# EAGLE schematic arduino_shield (EAGLE 7.1.0)

## Sheet 1 of 2: Arduino Sheild
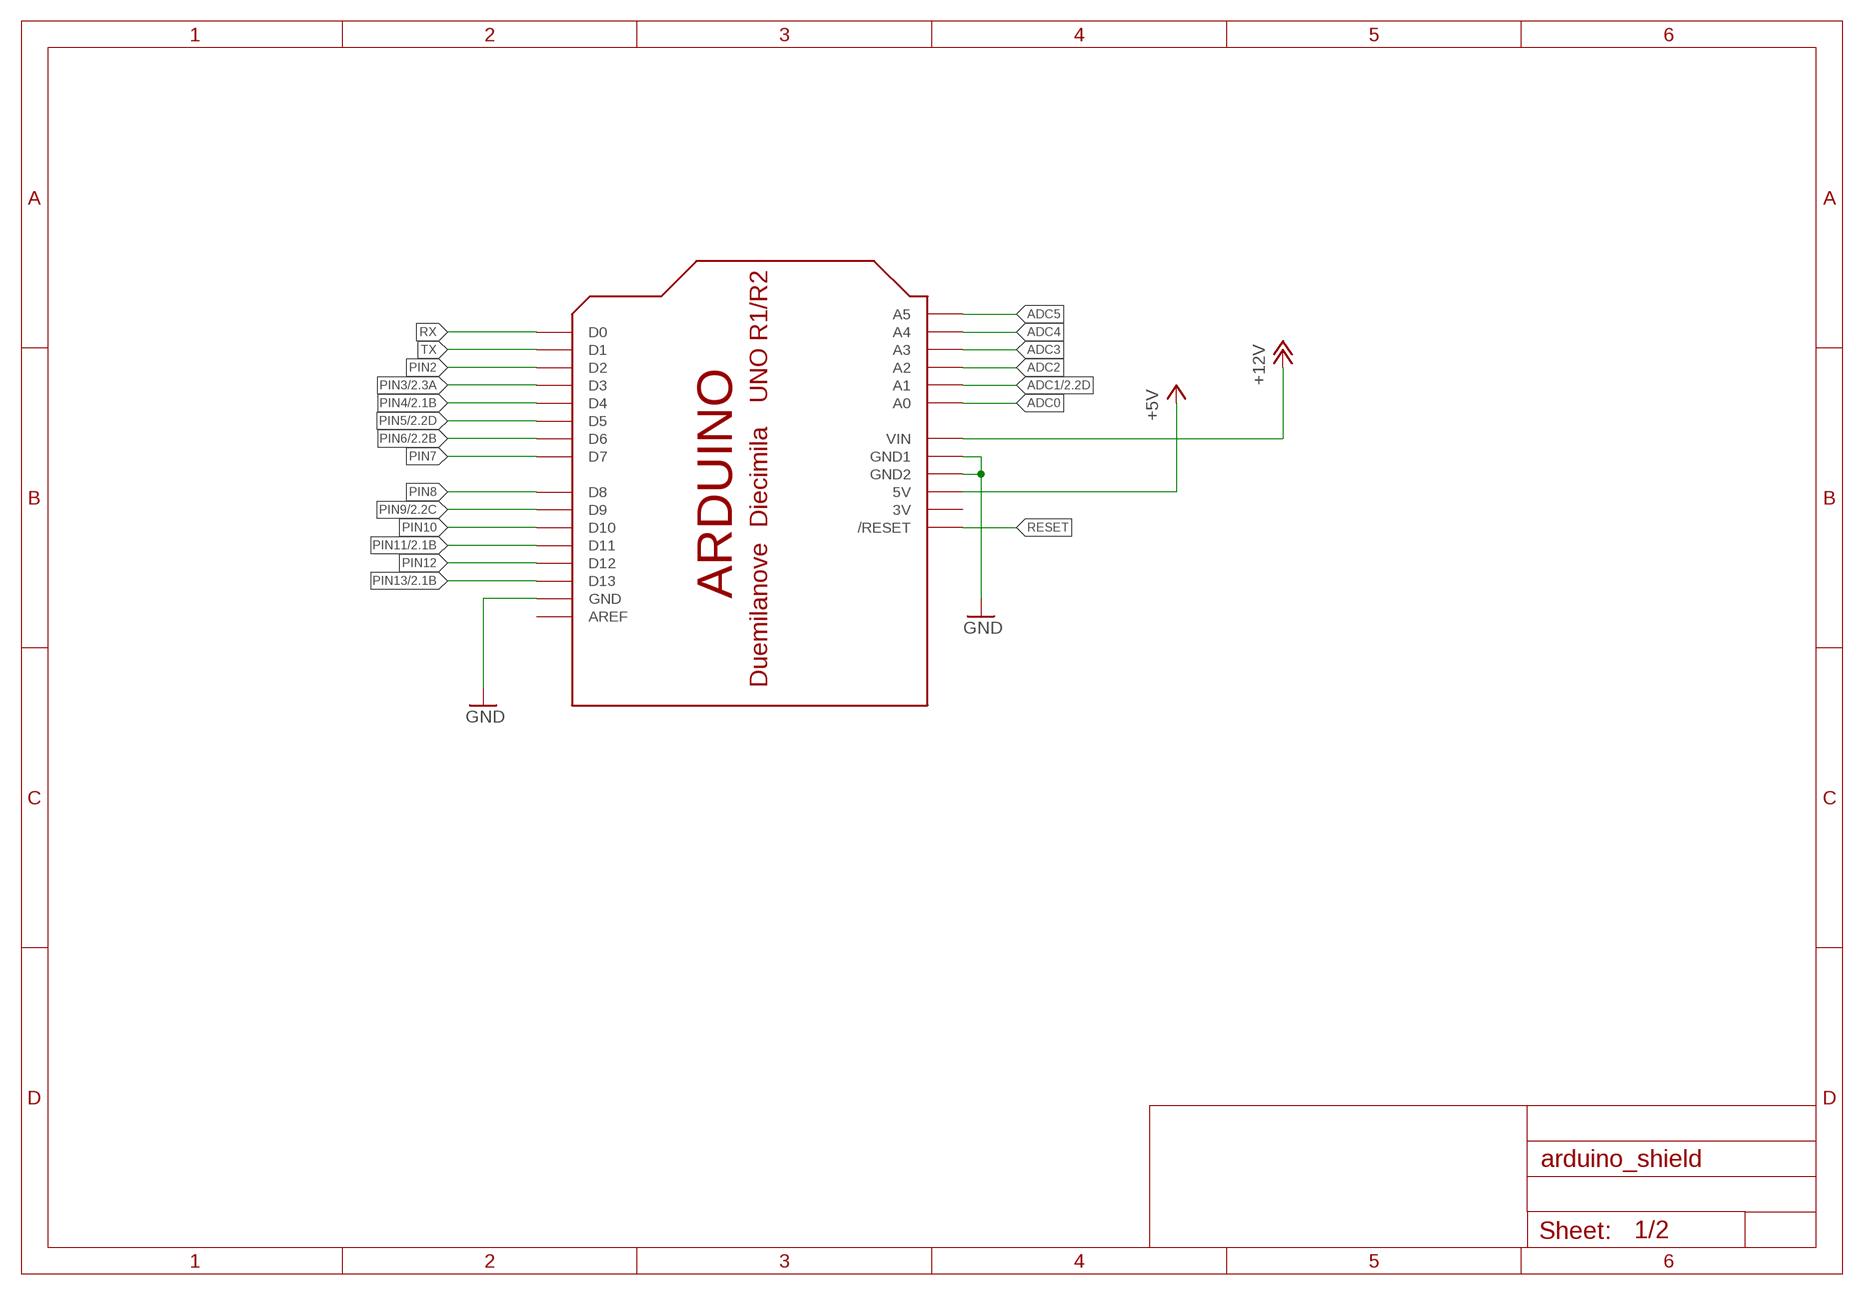
[diagram p0: schematic, sheet 1]

### Parts
GND  ARDUINOUNO  [ARDUINO]

### Nets
+5V: GND.5V ; also sheet 2
+12V: GND.VIN ; also sheet 2
ADC0: GND.A0
ADC1: GND.A1 ; also sheet 2
ADC2: GND.A2
ADC3: GND.A3
ADC4: GND.A4
ADC5: GND.A5
GND: GND.GND GND.GND1 GND.GND2 ; also sheet 2
PIN2: GND.D2
PIN3: GND.D3 ; also sheet 2
PIN4: GND.D4 ; also sheet 2
PIN5: GND.D5 ; also sheet 2
PIN6: GND.D6 ; also sheet 2
PIN7: GND.D7
PIN8: GND.D8
PIN9: GND.D9 ; also sheet 2
PIN10: GND.D10
PIN11: GND.D11 ; also sheet 2
PIN12: GND.D12
PIN13: GND.D13 ; also sheet 2
RESET: GND.RESET(/RESET)
RX: GND.D0
TX: GND.D1
Unconnected: GND.AREF

## Sheet 2 of 2: Output stage
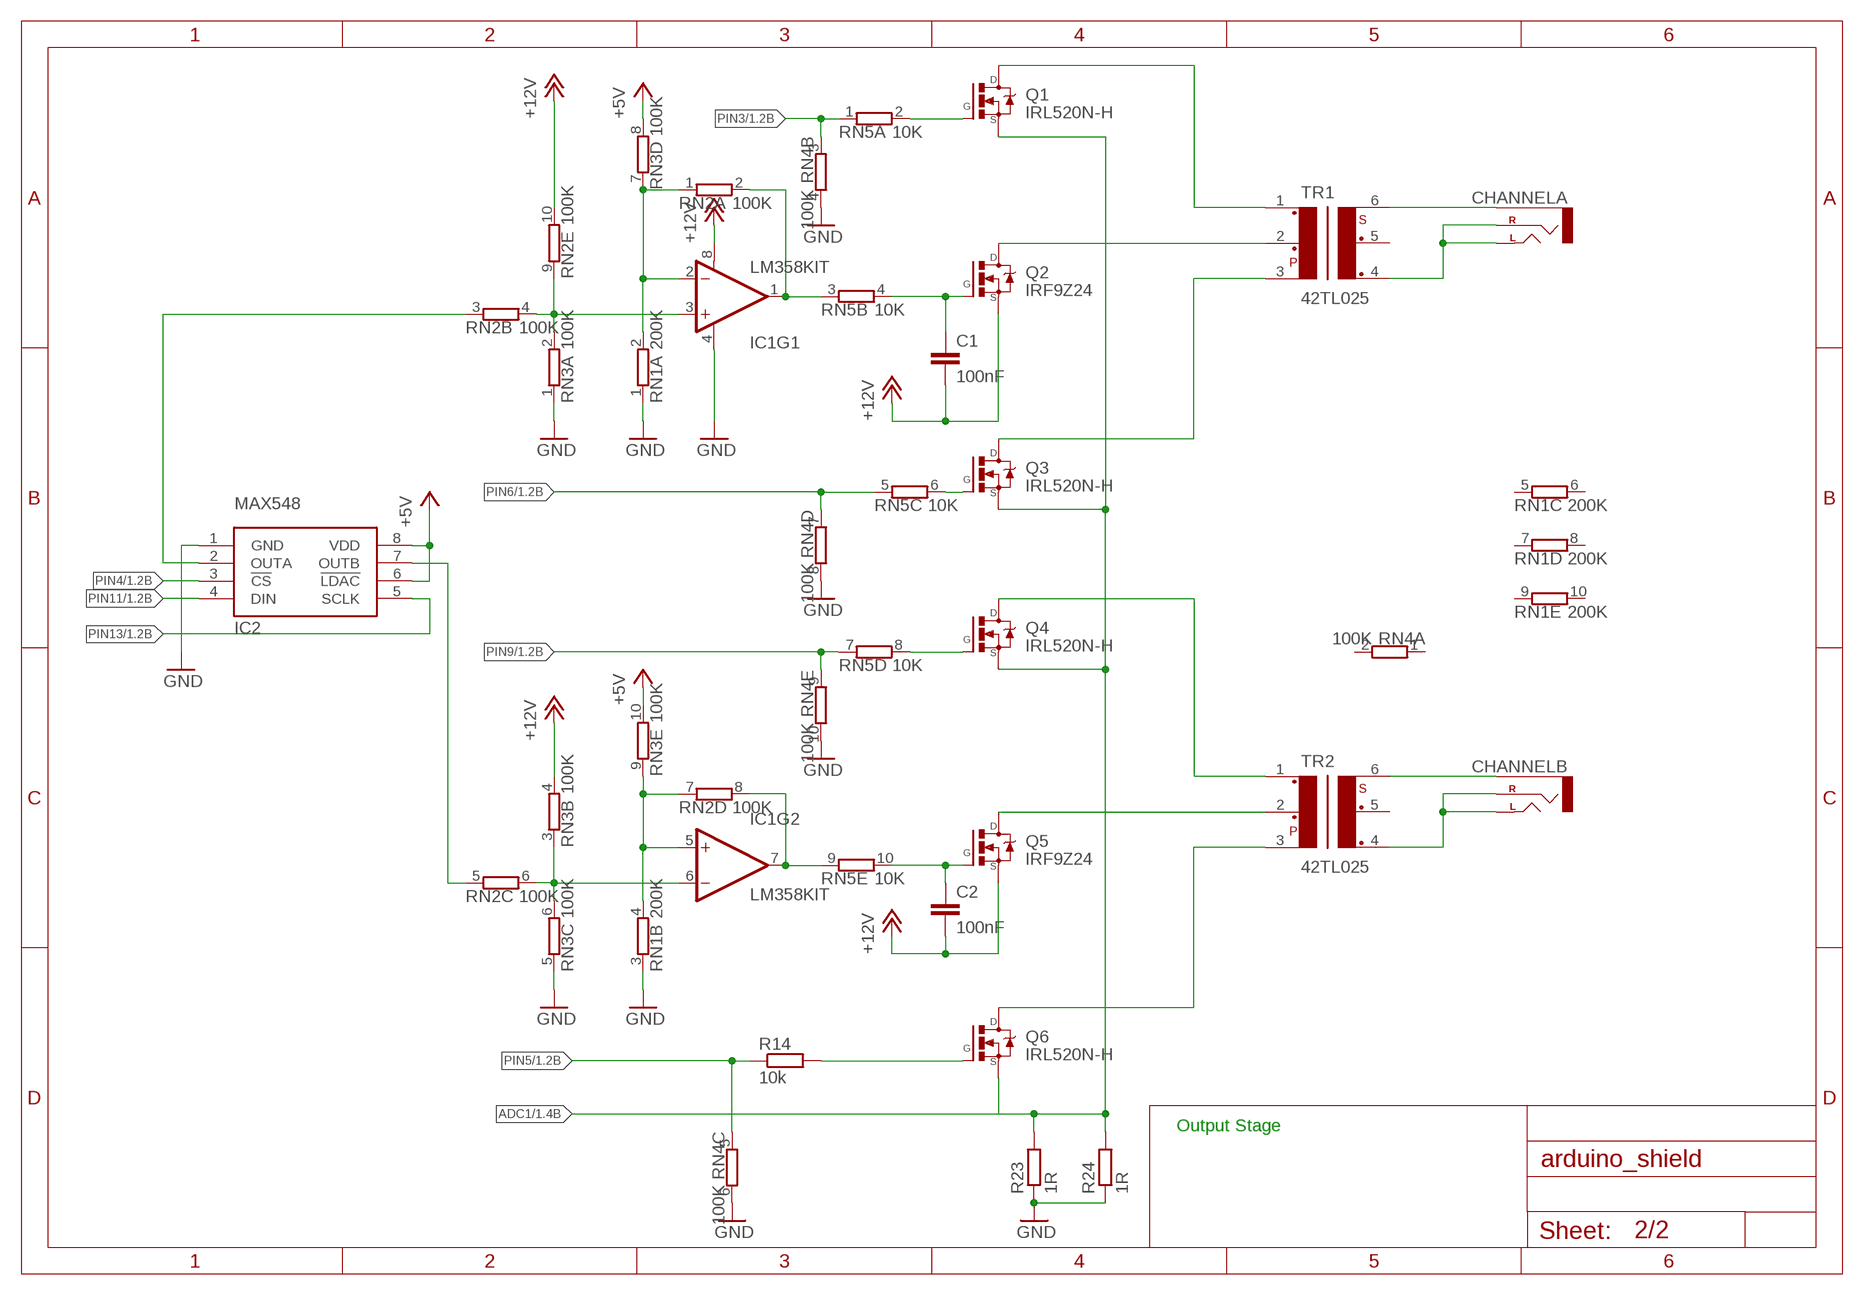
[diagram p1: schematic, sheet 2]

### Parts
C1  100nF  C2.5/2  [C2.5-2]
C2  100nF  C2.5/2  [C2.5-2]
CHANNELA  AUDIO-JACK2.5MM  [STEREOJACK2.5MM_STEREOJACK2.5MM]
CHANNELB  AUDIO-JACK2.5MM  [STEREOJACK2.5MM_STEREOJACK2.5MM]
IC1  LM358KIT  [DIP08-KIT]
IC2  MAX548  [DIL08]
Q1  IRL520N-H  IRL530N-V  [TO220V]
Q2  IRF9Z24  IRL530N-V  [TO220V]
Q3  IRL520N-H  IRL530N-V  [TO220V]
Q4  IRL520N-H  IRL530N-V  [TO220V]
Q5  IRF9Z24  IRL530N-V  [TO220V]
Q6  IRL520N-H  IRL530N-V  [TO220V]
R14  10k  R  [R0805]
R23  1R  R  [R0805]
R24  1R  R  [R0805]
RN1  200K  E5R  [SIL10]
RN2  100K  E5R  [SIL10]
RN3  100K  E5R  [SIL10]
RN4  100K  E5R  [SIL10]
RN5  10K  E5R  [SIL10]
TR1  42TL025  [42TL]
TR2  42TL025  [42TL]

### Nets
+5V: IC2.6(!LDAC) IC2.8(VDD) RN3.8 RN3.10 ; also sheet 1
+12V: C1.2 C2.2 IC1.8(V+) Q2.3(S) Q5.3(S) RN2.10 RN3.4 ; also sheet 1
ADC1: Q1.3(S) Q3.3(S) Q4.3(S) Q6.3(S) R23.2 R24.2 ; also sheet 1
GND: IC1.4(V-) IC2.1(GND) R23.1 R24.1 RN1.1 RN1.3 RN3.1 RN3.5 RN4.4 RN4.6 RN4.8 RN4.10 ; also sheet 1
N$1: CHANNELA.RING1(SLEEVE) TR1.6
N$2: CHANNELB.RING1(SLEEVE) TR2.6
N$3: CHANNELB.SHIELD(LEFT) CHANNELB.TIP(RIGHT) TR2.4
N$4: CHANNELA.SHIELD(LEFT) CHANNELA.TIP(RIGHT) TR1.4
N$5: IC2.2(OUTA) RN2.3
N$6: IC2.7(OUTB) RN2.5
N$18: Q1.1(G) RN5.2
N$19: Q3.1(G) RN5.6
N$20: IC1.1(OUT) RN2.2 RN5.3
N$21: C1.1 Q2.1(G) RN5.4
N$22: IC1.3(+IN) RN2.4 RN2.9 RN3.2
N$24: Q4.1(G) RN5.8
N$25: Q6.1(G) R14.2
N$26: IC1.7(OUT) RN2.8 RN5.9
N$27: C2.1 Q5.1(G) RN5.10
N$28: IC1.6(-IN) RN2.6 RN3.3 RN3.6
N$34: Q1.2(D) TR1.1
N$35: Q2.2(D) TR1.2
N$36: Q4.2(D) TR2.1
N$37: Q5.2(D) TR2.2
N$38: Q6.2(D) TR2.3
N$39: Q3.2(D) TR1.3
N$40: IC1.2(-IN) RN1.2 RN2.1 RN3.7
N$41: IC1.5(+IN) RN1.4 RN2.7 RN3.9
PIN3: RN4.3 RN5.1 ; also sheet 1
PIN4: IC2.3(!CS) ; also sheet 1
PIN5: R14.1 RN4.5 ; also sheet 1
PIN6: RN4.7 RN5.5 ; also sheet 1
PIN9: RN4.9 RN5.7 ; also sheet 1
PIN11: IC2.4(DIN) ; also sheet 1
PIN13: IC2.5(SCLK) ; also sheet 1
Unconnected: RN1.5 RN1.6 RN1.7 RN1.8 RN1.9 RN1.10 RN4.1 RN4.2 TR1.5 TR2.5

### Notes on the sheet
- Output Stage

## Power pins joined to a net without a drawn wire
3V: GND.3V

## Library data of the parts
C1 C2 = capacitor-wima:C: CAPACITOR naming: grid - package width
CHANNELA CHANNELB = SparkFun-Connectors:AUDIO-JACK: 3.5mm Audio Jack Simple 3.5mm common PCB mount audio jack. SKU: PRT-08032
GND = adafruit:ARDUINO: Arduino Diecimila/Duemilanove Make a shield with ease, this package has all the named pins as well as the two mounting drill holes and an outline of the USB and DC power connector. The outline is on the DIMENSION layer, so if your board house uses it they will cut the outline to match. http://www.ladyada.net/library/pcb/eaglelibrary.html
IC1 = SparkFun-AnalogIC:LM358: Jellybean op-amp; PROD_ID: IC-09172
IC2 = JAEB:MAX548
Q1-Q6 = transistor-fet-1:IRL530: MOSFET 17A 22.7nC 100mOhm Logic Level
R14 R23 R24 = eagle-ltspice:R: RESISTOR, European symbol; SPICEMODEL: NONE; SPICEPREFIX: R
RN1-RN5 = resistor-sil:E5R: SIL RESISTOR; OC_FARNELL: unknown; OC_NEWARK: unknown
TR1 TR2 = trafo-xicon:42T?*: Xicon Micro-Mini EI-12 Audio Transformers 42TL/42TC/42TM Series Source: http://www.mouser.com//catalog/specsheets/164201.pdf http://www.mouser.com/catalog/specsheets/114225.pdf http://www.mouser.com/catalog/specsheets/164267.pdf; OC_FARNELL: unknown; OC_NEWARK: unknown

## Net classes
0 default: width 0.4 mm
1 signal: width 0.254 mm
2 pwr: width 2 mm